# EAGLE schematic DASH_itr5_v3_labelled (EAGLE 9.6.2)

## Sheet 1 of 2
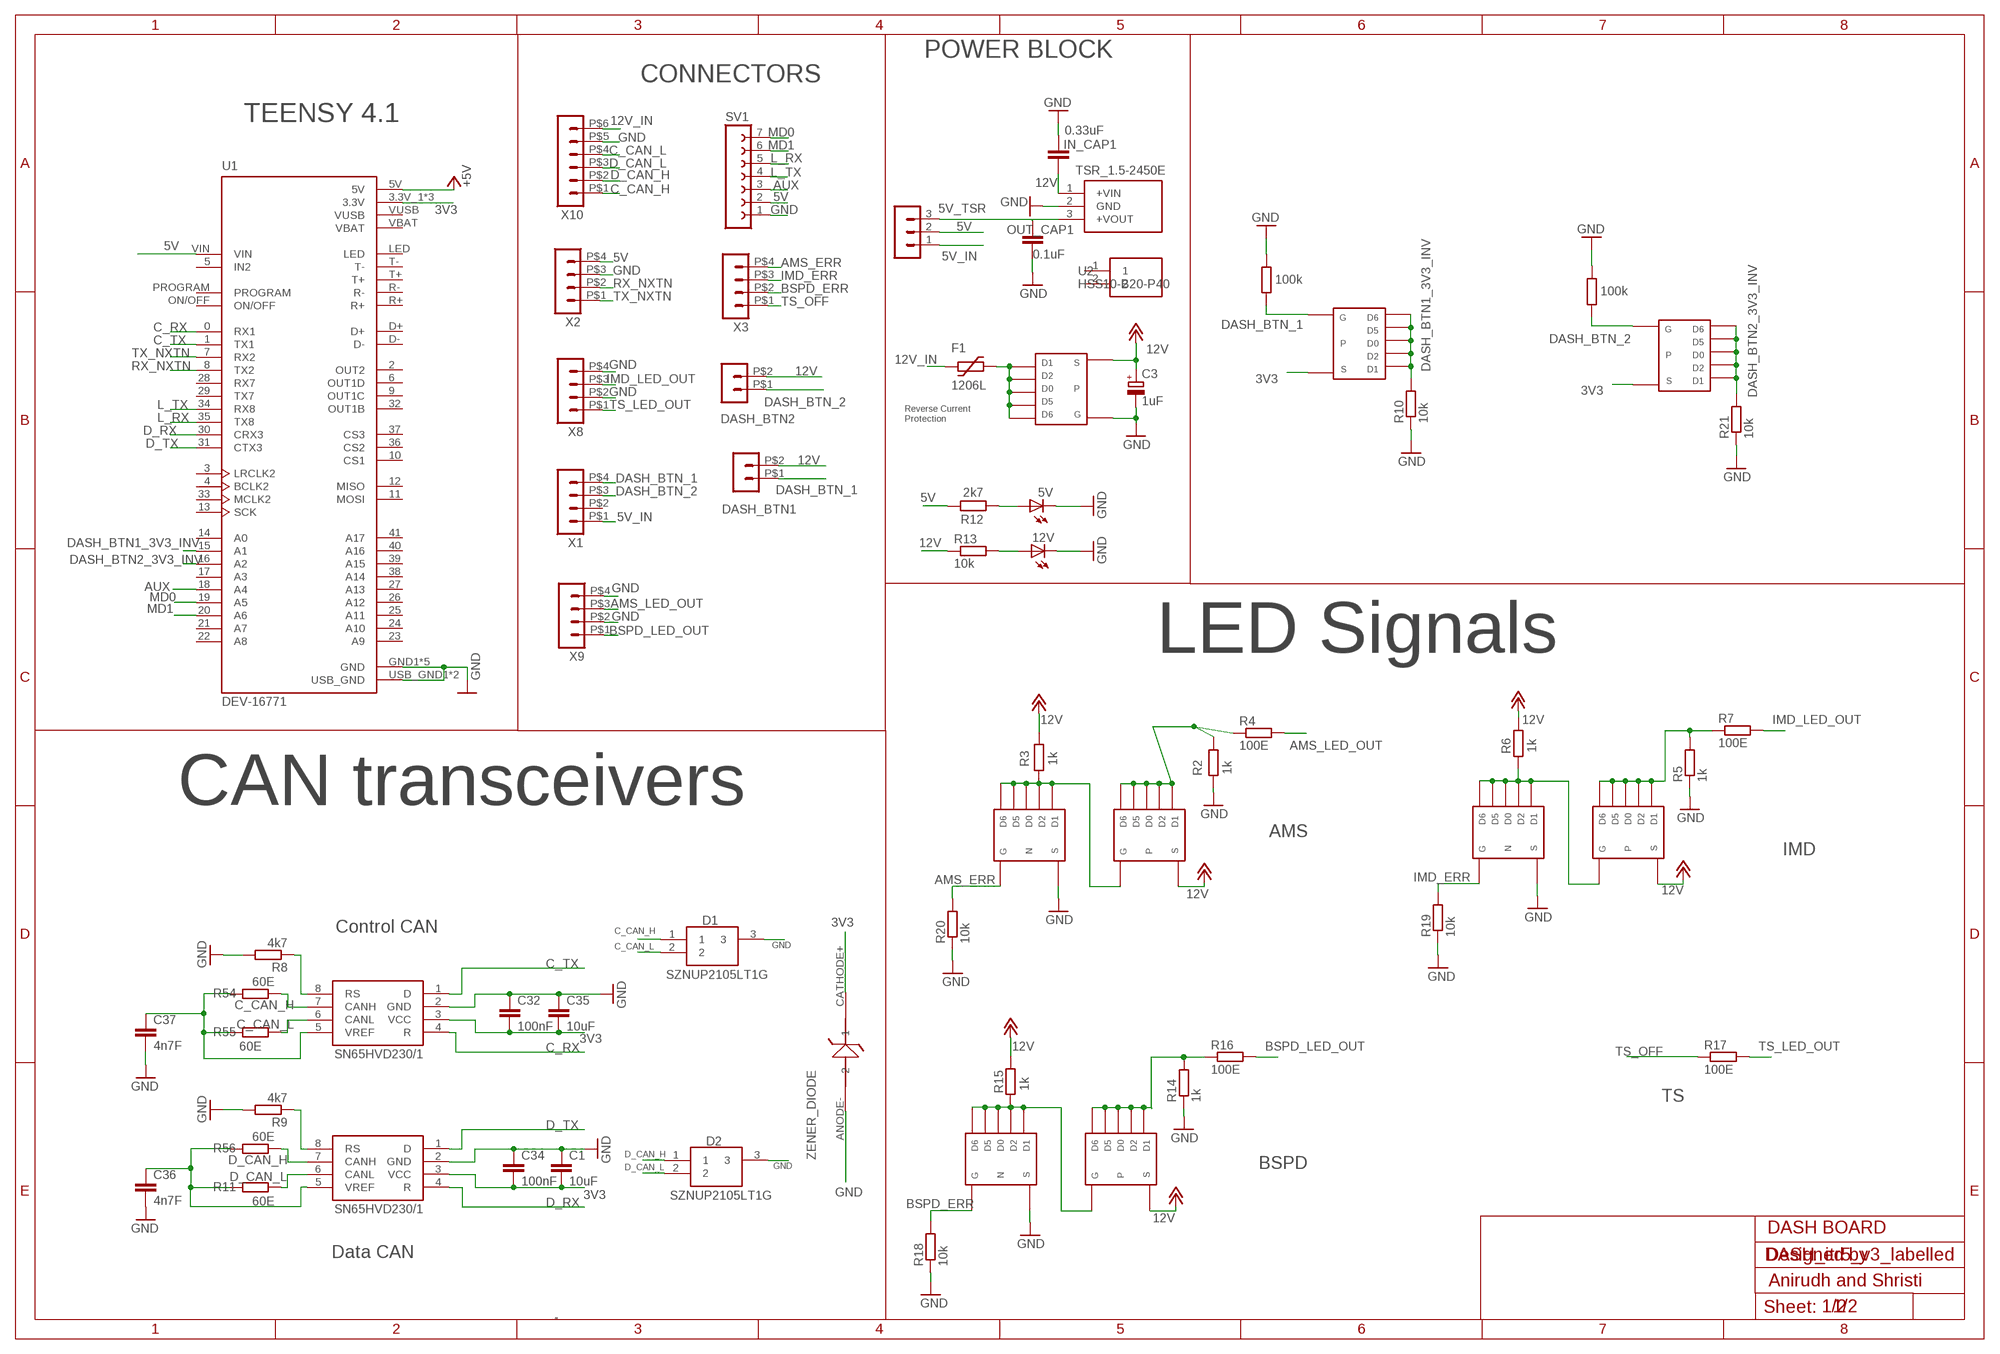
[diagram p0: schematic, sheet 1]

### Parts
5V  LED-FKIT-1206  [FKIT-LED-1206]
12V  LED-FKIT-1206  [FKIT-LED-1206]
C1  10uF  C-EUC0805  [C0805]
C3  1uF  CPOL-EUE2.5-6  [E2,5-6]
C32  100nF  C-EUC0805  [C0805]
C34  100nF  C-EUC0805  [C0805]
C35  10uF  C-EUC0805  [C0805]
C36  4n7F  C-EUC0805  [C0805]
C37  4n7F  C-EUC0805  [C0805]
D1  SZNUP2105LT1G  [SOT96P237X111-3N]
D2  SZNUP2105LT1G  [SOT96P237X111-3N]
DASH_BTN1  HEADER_POS2_43045-0212  [43045-0212]
DASH_BTN2  HEADER_POS2_43045-0212  [43045-0212]
F1  1206L  [1206L]
IN_CAP1  0.33uF  C-EUC0805  [C0805]
OUT_CAP1  0.1uF  C-EUC0805  [C0805]
PS2  TSR_1.5-2450E  [TSR152450E]
R1  100k  R-EU_R0805  [R0805]
R2  1k  R-EU_R0805  [R0805]
R3  1k  R-EU_R0805  [R0805]
R4  100E  R-EU_R0805  [R0805]
R5  1k  R-EU_R0805  [R0805]
R6  1k  R-EU_R0805  [R0805]
R7  100E  R-EU_R0805  [R0805]
R8  4k7  R-EU_R0805  [R0805]
R9  4k7  R-EU_R0805  [R0805]
R10  10k  R-EU_R0805  [R0805]
R11  60E  R-EU_R0805  [R0805]
R12  2k7  R-EU_R0805  [R0805]
R13  10k  R-EU_R0805  [R0805]
R14  1k  R-EU_R0805  [R0805]
R15  1k  R-EU_R0805  [R0805]
R16  100E  R-EU_R0805  [R0805]
R17  100E  R-EU_R0805  [R0805]
R18  10k  R-EU_R0805  [R0805]
R19  10k  R-EU_R0805  [R0805]
R20  10k  R-EU_R0805  [R0805]
R21  10k  R-EU_R0805  [R0805]
R35  100k  R-EU_R0805  [R0805]
R54  60E  R-EU_R0805  [R0805]
R55  60E  R-EU_R0805  [R0805]
R56  60E  R-EU_R0805  [R0805]
SV1  FE07-1  [FE07]
SV3  MA03-1  [MA03-1]
U1  DEV-16771  [MODULE_DEV-16771]
U2  HSS10-B20-P40  [HSS10B20P40]
U$1  SN65HVD230/1  [SO8]
U$3  SN65HVD230/1  [SO8]
U$4  TSOP-6_NMOS  [TSOP-6_NMOS]
U$5  TSOP-6_PMOS  [TSOP-6_PMOS]
U$6  TSOP-6_NMOS  [TSOP-6_NMOS]
U$9  TSOP-6_PMOS  [TSOP-6_PMOS]
U$10  TSOP-6_PMOS  [TSOP-6_PMOS]
U$11  TSOP-6_NMOS  [TSOP-6_NMOS]
U$12  TSOP-6_PMOS  [TSOP-6_PMOS]
U$13  TSOP-6_PMOS  [TSOP-6_PMOS]
U$14  TSOP-6_PMOS  [TSOP-6_PMOS]
U$20  ZENER_DIODE  [SOD323HE]
X1  HEADER_POS4_43045-0412  [43045-0412]
X2  HEADER_POS4_43045-0412  [43045-0412]
X3  HEADER_POS4_43045-0412  [43045-0412]
X8  HEADER_POS4_43045-0412  [43045-0412]
X9  HEADER_POS4_43045-0412  [43045-0412]
X10  HEADER_POS6_43045-0612  [43045-0612]

### Nets
3V3: C1.2 C32.2 C34.2 C35.2 U1.3.3V_1(3.3V) U1.3.3V_2(3.3V) U1.3.3V_3(3.3V) U$1.3(VCC) U$3.3(VCC) U$10.S U$12.S U$20.CATHODE+
5V: R12.2 SV1.2 SV3.2 U1.VIN X2.P$4
5V_IN: SV3.1 X1.P$1
5V_TSR: OUT_CAP1.1 PS2.3(+VOUT) SV3.3
12V: C3.+ DASH_BTN1.P$2 DASH_BTN2.P$2 IN_CAP1.1 PS2.1(+VIN) R3.2 R6.2 R13.1 R15.2 U$5.S U$9.S U$13.S U$14.S ; supply symbol labelled +12V
12V_IN: F1.P$1 X10.P$6
+5V: U1.5V
AMS_ERR: R20.2 U$4.G X3.P$4
AMS_LED_OUT: R4.2 X9.P$3
AUX: SV1.3 U1.18(A4)
BSPD_ERR: R18.2 U$11.G X3.P$2
BSPD_LED_OUT: R16.2 X9.P$1
C_CAN_H: D1.1 R54.1 U$3.7(CANH) X10.P$1
C_CAN_L: D1.2 R55.1 U$3.6(CANL) X10.P$4
C_RX: U1.0(RX1) U$3.4(R)
C_TX: U1.1(TX1) U$3.1(D)
D_CAN_H: D2.1 R56.1 U$1.7(CANH) X10.P$2
D_CAN_L: D2.2 R11.1 U$1.6(CANL) X10.P$3
D_RX: U1.30(CRX3) U$1.4(R)
D_TX: U1.31(CTX3) U$1.1(D)
DASH_BTN1_3V3_INV: R10.2 U1.15(A1) U$10.1 U$10.2 U$10.5 U$10.6 U$10.D(D0)
DASH_BTN2_3V3_INV: R21.2 U1.16(A2) U$12.1 U$12.2 U$12.5 U$12.6 U$12.D(D0)
DASH_BTN_1: DASH_BTN1.P$1 R35.1 U$10.G X1.P$4
DASH_BTN_2: DASH_BTN2.P$1 R1.1 U$12.G X1.P$3
GND: 5V.C 12V.C C1.1 C3.- C32.1 C34.1 C35.1 C36.2 C37.2 D1.3 D2.3 IN_CAP1.2 OUT_CAP1.2 PS2.2(GND) R1.2 R2.1 R5.1 R8.2 R9.2 R10.1 R14.1 R18.1 R19.1 R20.1 R21.1 R35.2 SV1.1 U1.GND1(GND) U1.GND2(GND) U1.GND3(GND) U1.GND4(GND) U1.GND5(GND) U1.USB_GND1(USB_GND) U1.USB_GND2(USB_GND) U$1.2(GND) U$3.2(GND) U$4.S U$6.S U$11.S U$13.G U$20.ANODE- X2.P$3 X8.P$2 X8.P$4 X9.P$2 X9.P$4 X10.P$5
IMD_ERR: R19.2 U$6.G X3.P$3
IMD_LED_OUT: R7.2 X8.P$3
L_RX: SV1.5 U1.35(TX8)
L_TX: SV1.4 U1.34(RX8)
MD0: SV1.7 U1.19(A5)
MD1: SV1.6 U1.20(A6)
N$1: R2.2 R4.1 U$5.1 U$5.2 U$5.5 U$5.6 U$5.D(D0)
N$4: 12V.A R13.2
N$6: 5V.A R12.1
N$7: R3.1 U$4.1 U$4.2 U$4.5 U$4.6 U$4.D(D0) U$5.G
N$9: R15.1 U$11.1 U$11.2 U$11.5 U$11.6 U$11.D(D0) U$14.G
N$10: R14.2 R16.1 U$14.1 U$14.2 U$14.5 U$14.6 U$14.D(D0)
N$11: R5.2 R7.1 U$9.1 U$9.2 U$9.5 U$9.6 U$9.D(D0)
N$13: R6.1 U$6.1 U$6.2 U$6.5 U$6.6 U$6.D(D0) U$9.G
N$32: R8.1 U$3.8(RS)
N$33: C37.1 R54.2 R55.2 U$3.5(VREF)
N$35: C36.1 R11.2 R56.2 U$1.5(VREF)
N$37: R9.1 U$1.8(RS)
N$46: F1.P$2 U$13.1 U$13.2 U$13.5 U$13.6 U$13.D(D0)
RX_NXTN: U1.8(TX2) X2.P$2
TS_LED_OUT: R17.2 X8.P$1
TS_OFF: R17.1 X3.P$1
TX_NXTN: U1.7(RX2) X2.P$1
Unconnected: U1.2(OUT2) U1.3(LRCLK2) U1.4(BCLK2) U1.5(IN2) U1.6(OUT1D) U1.9(OUT1C) U1.10(CS1) U1.11(MOSI) U1.12(MISO) U1.13(SCK) U1.14(A0) U1.17(A3) U1.21(A7) U1.22(A8) U1.23(A9) U1.24(A10) U1.25(A11) U1.26(A12) U1.27(A13) U1.28(RX7) U1.29(TX7) U1.32(OUT1B) U1.33(MCLK2) U1.36(CS2) U1.37(CS3) U1.38(A14) U1.39(A15) U1.40(A16) U1.41(A17) U1.D+ U1.D- U1.LED U1.ON/OFF U1.PROGRAM U1.R+ U1.R- U1.T+ U1.T- U1.VBAT U1.VUSB U2.1 U2.2 X1.P$2

### Notes on the sheet
- POWER BLOCK
- CONNECTORS
- TEENSY 4.1
- Reverse Current
  Protection
- LED Signals
- CAN transceivers
- AMS
- IMD
- Control CAN
- TS
- BSPD
- DASH BOARD
- Data CAN | Designed by
- Anirudh and Shristi
- 1/2

## Sheet 2 of 2
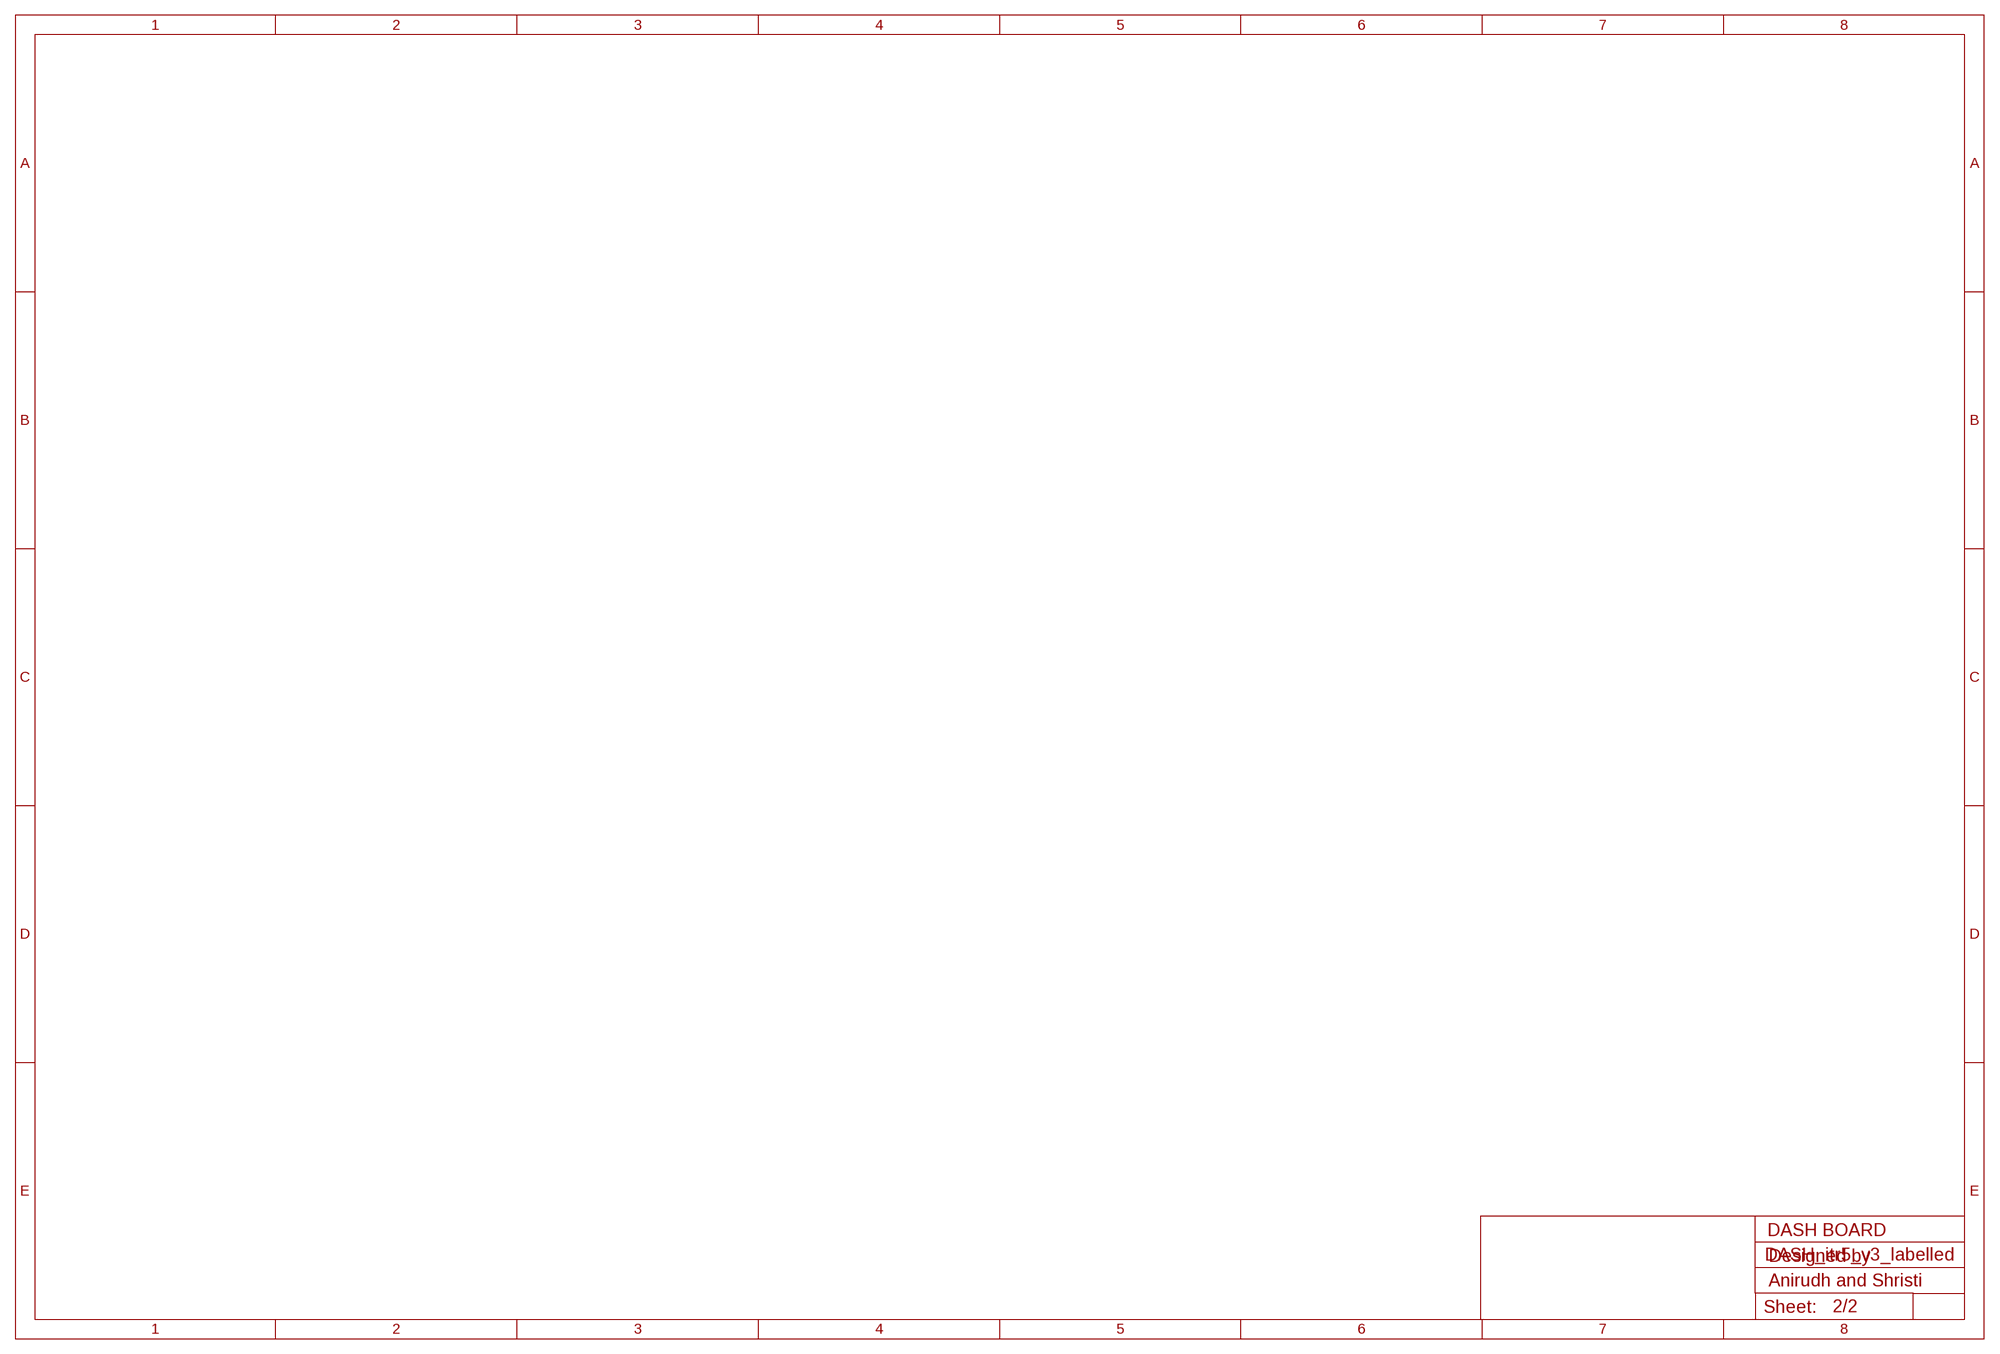
[diagram p1: schematic, sheet 2]

### Notes on the sheet
- DASH BOARD
- Designed by
- Anirudh and Shristi

## Library data of the parts
5V 12V = IIT_BOMBAY_Racing:LED: LEDs Standard schematic elements and footprints for 5mm, 3mm, 1206, and 0603 sized LEDs. 5mm - Spark Fun Electronics SKU : COM-00529 (and others)
C1 C32 C34-C37 IN_CAP1 OUT_CAP1 = IIT_BOMBAY_Racing:C-EU: CAPACITOR, European symbol
C3 = IIT_BOMBAY_Racing:CPOL-EU: POLARIZED CAPACITOR, European symbol
D1 D2 = SamacSys_Parts:SZNUP2105LT1G: Dual Bi-Directional TVS Diode, 350W peak, 3-pin SOT-23 Source: Datasheet <http://www.onsemi.com/pub/Collateral/NUP2105L-D.PDF>; DESCRIPTION: Dual Bi-Directional TVS Diode, 350W peak, 3-pin SOT-23; HEIGHT: 1.11mm; MANUFACTURER_NAME: ON Semiconductor; MANUFACTURER_PART_NUMBER: SZNUP2105LT1G; MOUSER_PART_NUMBER: 863-SZNUP2105LT1G; MOUSER_PRICE-STOCK: https://www.mouser.co.uk/ProductDetail/ON-Semiconductor/SZNUP2105LT1G?qs=PJJcWtbOkNWqqZbXH80dfQ%3D%3D
DASH_BTN1 DASH_BTN2 = IIT_BOMBAY_Racing:HEADER_POS2_?: Molex - Micro-Fit 3.0 Series connector, 3.00mm (0.118") pitch header, 2 positions.
F1 = IIT_BOMBAY_Racing:1206L
PS2 = TSR_1.5-2450E:TSR_1.5-2450E: 1.5 Amp POL converter, industrial, 7-36 VDC input, pos.-pos. circuit, cost efficient, LM78 compatible, SIP-3 Source: Datasheet <https://tracopower.com/tsr1-5e-datasheet/>; DESCRIPTION: 1.5 Amp POL converter, industrial, 7-36 VDC input, pos.-pos. circuit, cost efficient, LM78 compatible, SIP-3; HEIGHT: 10.7mm; MANUFACTURER_NAME: Traco Power; MANUFACTURER_PART_NUMBER: TSR 1.5-2450E; MOUSER_PART_NUMBER: 495-TSR1.5-2450E; MOUSER_PRICE-STOCK: https://www.mouser.co.uk/ProductDetail/TRACO-Power/TSR-1.5-2450E?qs=stqOd1AaK79hgyCu6Bsrpg%3D%3D
R1-R12 R14-R21 R35 R54-R56 = IIT_BOMBAY_Racing:R-EU_: RESISTOR, European symbol
R13 = rcl:R-EU_: RESISTOR, European symbol; SPICEPREFIX: R
SV1 = con-lsta:FE07-1: FEMALE HEADER; OC_FARNELL: unknown; OC_NEWARK: unknown
SV3 = con-lstb:MA03-1: PIN HEADER; OC_FARNELL: unknown; OC_NEWARK: unknown
U1 = DEV-16771:DEV-16771: RT1062 Teensy 4.1 i.MX ARM Cortex-M7 MPU Embedded Evaluation Board Check availability <https://pricing.snapeda.com/parts/DEV-16771/SparkFun%20Electronics/view-part?ref=eda>; AVAILABILITY: In Stock; DESCRIPTION: RT1062 Teensy 4.1 series ARM® Cortex®-M7 MPU Embedded Evaluation Board; MF: SparkFun Electronics; MP: DEV-16771; PACKAGE: None; PRICE: None; PURCHASE-URL: https://pricing.snapeda.com/search/part/DEV-16771/?ref=eda
U2 = SamacSys_Parts:HSS10-B20-P40: Heat Sinks heat sink, stamping, TO-220, 29.97 x 25. Source: Datasheet <https://www.cuidevices.com/product/resource/hss10-b20-p40.pdf>; DESCRIPTION: Heat Sinks heat sink, stamping, TO-220, 29.97 x 25.; HEIGHT: 29.97mm; MANUFACTURER_NAME: CUI Inc.; MANUFACTURER_PART_NUMBER: HSS10-B20-P40; MOUSER_PART_NUMBER: 490-HSS10-B20-P40; MOUSER_PRICE-STOCK: https://www.mouser.co.uk/ProductDetail/CUI-Devices/HSS10-B20-P40?qs=QNEnbhJQKvYYvwy4FCjq1A%3D%3D
U$1 U$3 = texas_1:SN65HVD230/1
U$4 U$6 U$11 = ACU-MOSFET-updated:TSOP-6_NMOS
U$5 U$9 U$10 U$12-U$14 = TSOP-6_MOS:TSOP-6_PMOS
U$20 = mylib:ZENER_DIODE
X1-X3 X8 X9 = IIT_BOMBAY_Racing2:HEADER_POS4_?: Molex - Micro-Fit 3.0 Series connector, 3.00mm (0.118") pitch header, 4 positions.
X10 = IIT_BOMBAY_Racing2:HEADER_POS6_?: Molex - Micro-Fit 3.0 Series connector, 3.00mm (0.118") pitch header, 6 positions.